# Altium project CHILD_BOARD.PrjPcb
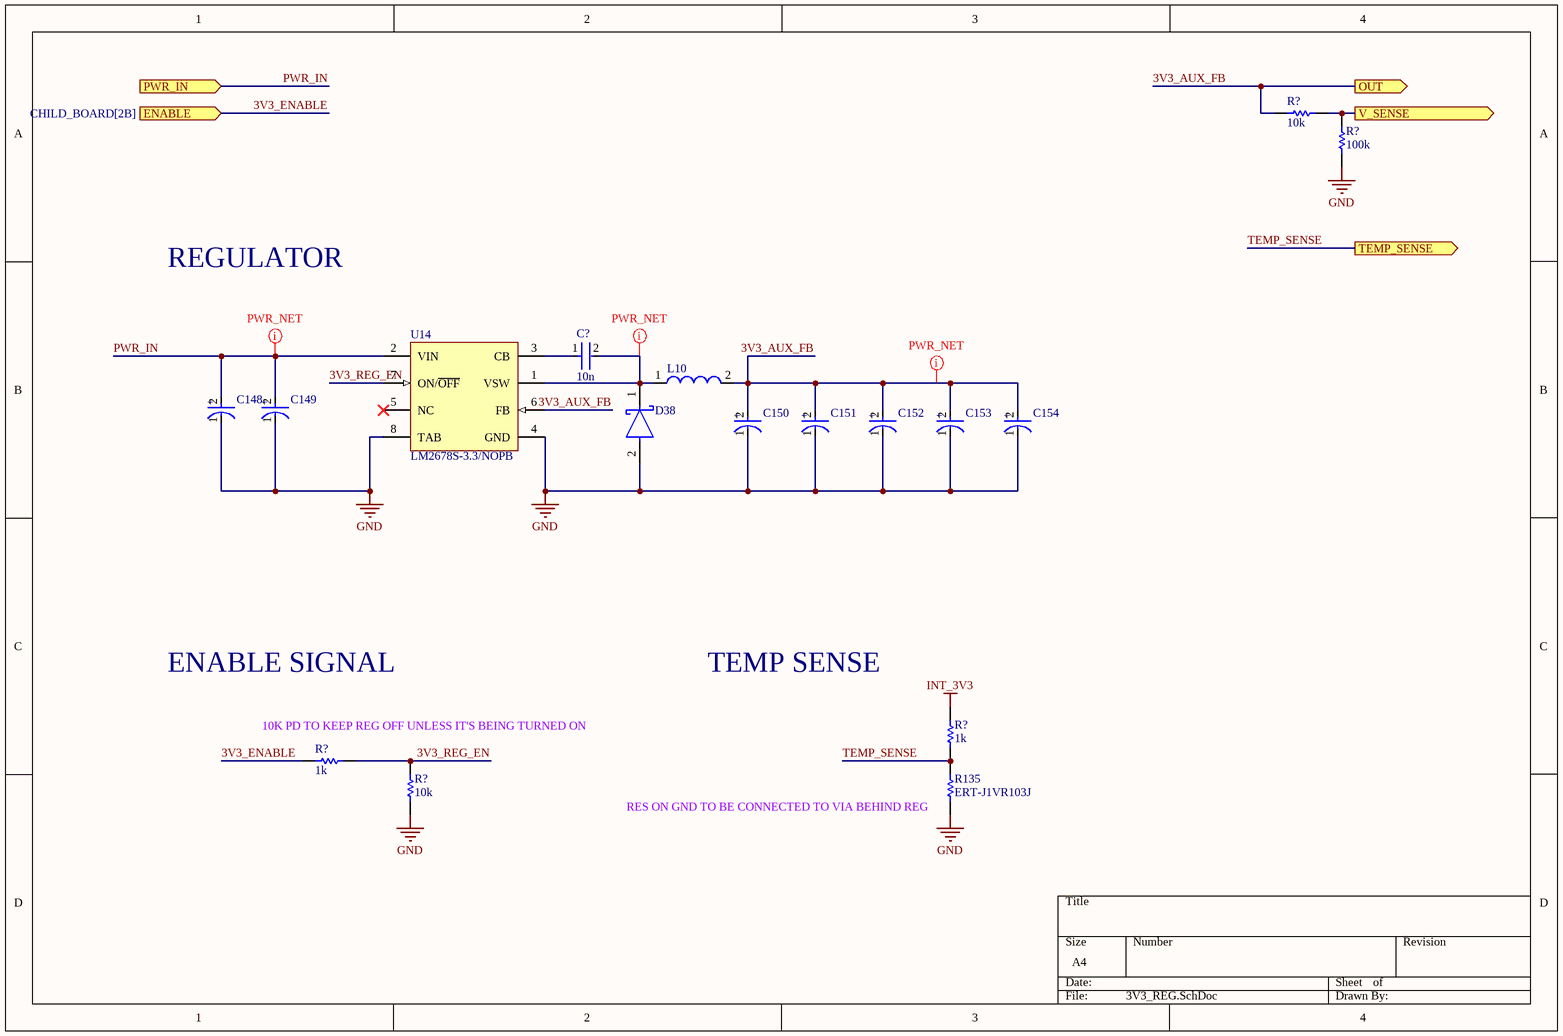
[diagram p0: 3V3_REG.SchDoc]
3 sheets, 44 parts. Net scope: flat (ports and power ports of the same name join across sheets).
Board file: CHILD_BOARD_revA.PcbDoc
Sheets:
  3V3_REG.SchDoc
  5V_REG.SchDoc
  INT_REG.SchDoc

## Sheet 3V3_REG.SchDoc
size A4; SheetNumber: 3; SheetTotal: 12

### Parts
(Parts that share a designator on the sheet are numbered #1, #2 ... from top to bottom, then left to right.)
C148  EEHZA1V680XP  [FP-EEH-D8-MFG]  (value not drawn)
C149  EEHZA1V680XP  [FP-EEH-D8-MFG]  (value not drawn)
C150  16SVPC120M  [FP-OS-CON-SMT-E7-MFG]  (value not drawn)
C151  16SVPC120M  [FP-OS-CON-SMT-E7-MFG]  (value not drawn)
C152  16SVPC120M  [FP-OS-CON-SMT-E7-MFG]  (value not drawn)
C153  16SVPC120M  [FP-OS-CON-SMT-E7-MFG]  (value not drawn)
C154  16SVPC120M  [FP-OS-CON-SMT-E7-MFG]  (value not drawn)
C?#1  10n  [FP-0402-L_1_0_0_05-W_0_5-IPC_A]
D38  B540C-13-F  [FP-SMC-MFG]  (value not drawn)
L10  74477110  [WE-PD-L]  (value not drawn)
R135  ERT-J1VR103J  [RESC1608X90X30ML15T20]
R?#1  10k  [R0603B]
R?#2  100k  [R0603B]
R?#3  1k  [R0603B]
R?#4  1k  [R0603B]
R?#5  10k  [R0603B]
U14  LM2678S-3.3/NOPB  [KTW0007B_N]

### Ports
ENABLE (in, see CHILD_BOARD[2B]), OUT (out, see CHILD_BOARD[3B]), PWR_IN (in, see CHILD_BOARD[2B]), TEMP_SENSE (out, see CHILD_BOARD[3B]), V_SENSE (out, see CHILD_BOARD[3B])

### Nets
GND: C148.1(C) C149.1(C) C150.1(C) C151.1(C) C152.1(C) C153.1(C) C154.1(C) D38.2(A) R135.1 R?#2.2 R?#5.2 U14.4(GND) U14.8(TAB)
INT_3V3: R?#3.1
3V3_AUX_FB: C150.2(A) C151.2(A) C152.2(A) C153.2(A) C154.2(A) L10.2 R?#1.1 U14.6(FB) ; port OUT
3V3_ENABLE: R?#4.2 ; port ENABLE
3V3_REG_EN: R?#4.1 R?#5.1 U14.7(ON/~{OFF})
PWR_IN: C148.2(A) C149.2(A) U14.2(VIN) ; port PWR_IN
TEMP_SENSE: R135.2 R?#3.2 ; port TEMP_SENSE
NetC?#1_1: C?#1.1 U14.3(CB)
NetC?#1_2: C?#1.2 D38.1(C) L10.1 U14.1(VSW)
NetR?#1_2: R?#1.2 R?#2.1 ; port V_SENSE

Not connected (* = marked no-connect by the designer): U14 5(NC)*

### Layout directives
net class PWR: 3V3_AUX_FB, NetC?#1_2, PWR_IN

### Notes on the sheet
- REGULATOR
- ENABLE SIGNAL
- TEMP SENSE
- (near R?#4) 10K PD TO KEEP REG OFF UNLESS IT'S BEING TURNED ON
- RES ON GND TO BE CONNECTED TO VIA BEHIND REG
- (in symbol CMP-05428-000021-2) +
- (in symbol CMP-05428-001211-1) +

### Library data of the parts
C148 C149 = CMP-05428-001211-1: Conductive Polymer Hybrid Aluminum Electrolytic Capacitors 68uF ±20% 35V RADIAL SMT 6.3x7.7mm; Leakage Current: 23.8uA; Ripple Current (AC): 2A; Polarity: Polar; Life (Hours): 5000Hour; ESR (Equivalent Series Resistance): 35mR; Lead Diameter: 0.65mm; Termination: SMD/SMT; Case/Package: Radial; Package Quantity: 900; Radiation Hardening: No; Max Operating Temperature: 105°C; Capacitance: 68uF; Voltage Rating: 35V; Number of Pins: 8; Mount: Surface Mount; Technology: HYBRID; Diameter: 6.3mm; Min Operating Temperature: -55°C; Length: 7.7mm; Ratings: AEC-Q200; Height - Seated (Max): 0.315inch; Ripple Current: 2A; Lead Free: Lead Free; Voltage: 35V; Lead Pitch: 1.8mm; Voltage Rating (DC): 35V; REACH SVHC: No SVHC; Material: Polymer; Height: 7.7mm; Tolerance: 20%; Construction: Cylindrical; Packaging: Tape and Reel; Series: ZA
C150-C154 = CMP-05428-000021-2: Conductive Polymer Aluminum Solid Capacitors (OS-CON) 120uF ±20% 16V RADIAL SMT 8x6.9mm; Leakage Current: 500uA; Ripple Current: 2.9A; ESR (Equivalent Series Resistance): 27mR; Polarity: Polar; Dissipation Factor: 12%; Life (Hours): 2000Hour; Lead Free: Lead Free; Voltage Rating (DC): 16V; Min Operating Temperature: -55°C; Height - Seated (Max): 0.276inch; Case/Package: Radial; REACH SVHC: No SVHC; Diameter: 8mm; Mount: Surface Mount; Package Quantity: 1000; Construction: Cylindrical; Max Operating Temperature: 105°C; Capacitance: 120uF; Voltage: 16V; Length: 6.9mm; Tolerance: 20%; RoHS Compliant: Yes; Series: OS-CON, SVPC; Packaging: Tape and Reel; Voltage Rating: 16V; Termination: SMD/SMT; Number of Pins: 7; Ripple Current (AC): 2.9A; Height: 6.9mm
C?#1 = CMP-001-00058-1: LARGE PADS, 0402 CAP, CHANGE COMMENT TO MATCH REAL P/N; Capacitor Type: Ceramic; Min Operating Temperature: -55°C; Mounting Technology: Surface Mount; Pins: 2; Case/Package: 0402; RoHS Compliant: Yes; Max Operating Temperature: 85°C
D38 = CMP-2000-05097-3: DIODE SCHOTTKY 40V 5A SMC; Manufacturer: Diodes Inc.; Automotive Grade: NA; Peak Reverse Current: 0.5mA; Value: 300pF; Max Junction Temp: +150°C; Max Surge Forward Current: 100A; Standoff Height: 0.1mm; Digikey Description: DIODE SCHOTTKY 40V 5A SMC; Temperature Range Low: -55°C; Manufacturer Part Number: B540C-13-F; Octopart: https://octopart.com/b540c-13-f-diodes+inc.-325873; Lead Free: Yes; Reverse Voltage: 40V; RoHS: TRUE; Category: Diode; Mouser Description: Diode: Schottky rectifying; SMD; 40V; 5A; SMC; Package: reel, tape; ComponentLink2Description: Datasheet; Temperature Range High: +150°C; Automotive: No; Footprint Url: https://www.diodes.com/assets/Package-Files/SMC.pdf; Device Class L3: Schottky Diodes; Height: 2.5mm; Forward Current: 5A; Temperature: -55°C to +150°C; Package: SMC; ComponentLink2URL: https://www.diodes.com/assets/Datasheets/ds13012.pdf; Device Class L2: Diodes; Max Repetitive Reverse Voltage: 40V; Device Class L1: Discrete Semiconductors; Capacitance: 300pF
L10 = CMP-0227-00708-1: SMD-Shielded Power Inductor WE-PD, L = 10.0 µH; Inductance: 10.0 ÂµH; ComponentLink2Description: Datasheet; DatasheetVersion: ver 7, Sep-2006; PackageVersion: 2006; ComponentLink1URL: http://www.we-online.com; ComponentLink1Description: Manufacturer Link; ComponentLink2URL: http://www.we-online.de/katalog/media/pdf/74477110.pdf; PackageDescription: SMD Inductor, 2-Leads, Body 12.0 x 12.0 mm; PackageReference: WE-PD-L
R135 = CMP-2000-00869-1: Manufacturer: Panasonic; Part Number: ERT-J1VR103J
R?#1-R?#5 = CMP-009-00002-14: Resistor
  R?#1 R?#5: Value: 10k
  R?#2: Value: 100k
  R?#3 R?#4: Value: 1k
U14 = CMP-0069-00195-3: SIMPLE SWITCHER® High Efficiency 5A Step-Down Voltage Regulator, 7-pin TO-263, Pb-Free; Manufacturer: Texas Instruments; PackageTopMarking: NSUZXYTTE#*LM2678*S-3.3; PowerWise: N; PackageReference: KTW0007B; Code_JEDEC: MO-169-AC; CompType: Switcher; RoHS: Y; PackageDescription: TO-263, Molded, .400 x .390 x .180in Body, 7 Lead, .050in Pitch, Surface Mount; ComponentLink1Description: Datasheet URL; PinCount: 7; ComponentLink1URL: http://www.ti.com/general/docs/lit/getliterature.tsp?genericPartNumber=LM2678&fileType=pdf

## Sheet 5V_REG.SchDoc
size A4; SheetNumber: 4; SheetTotal: 12
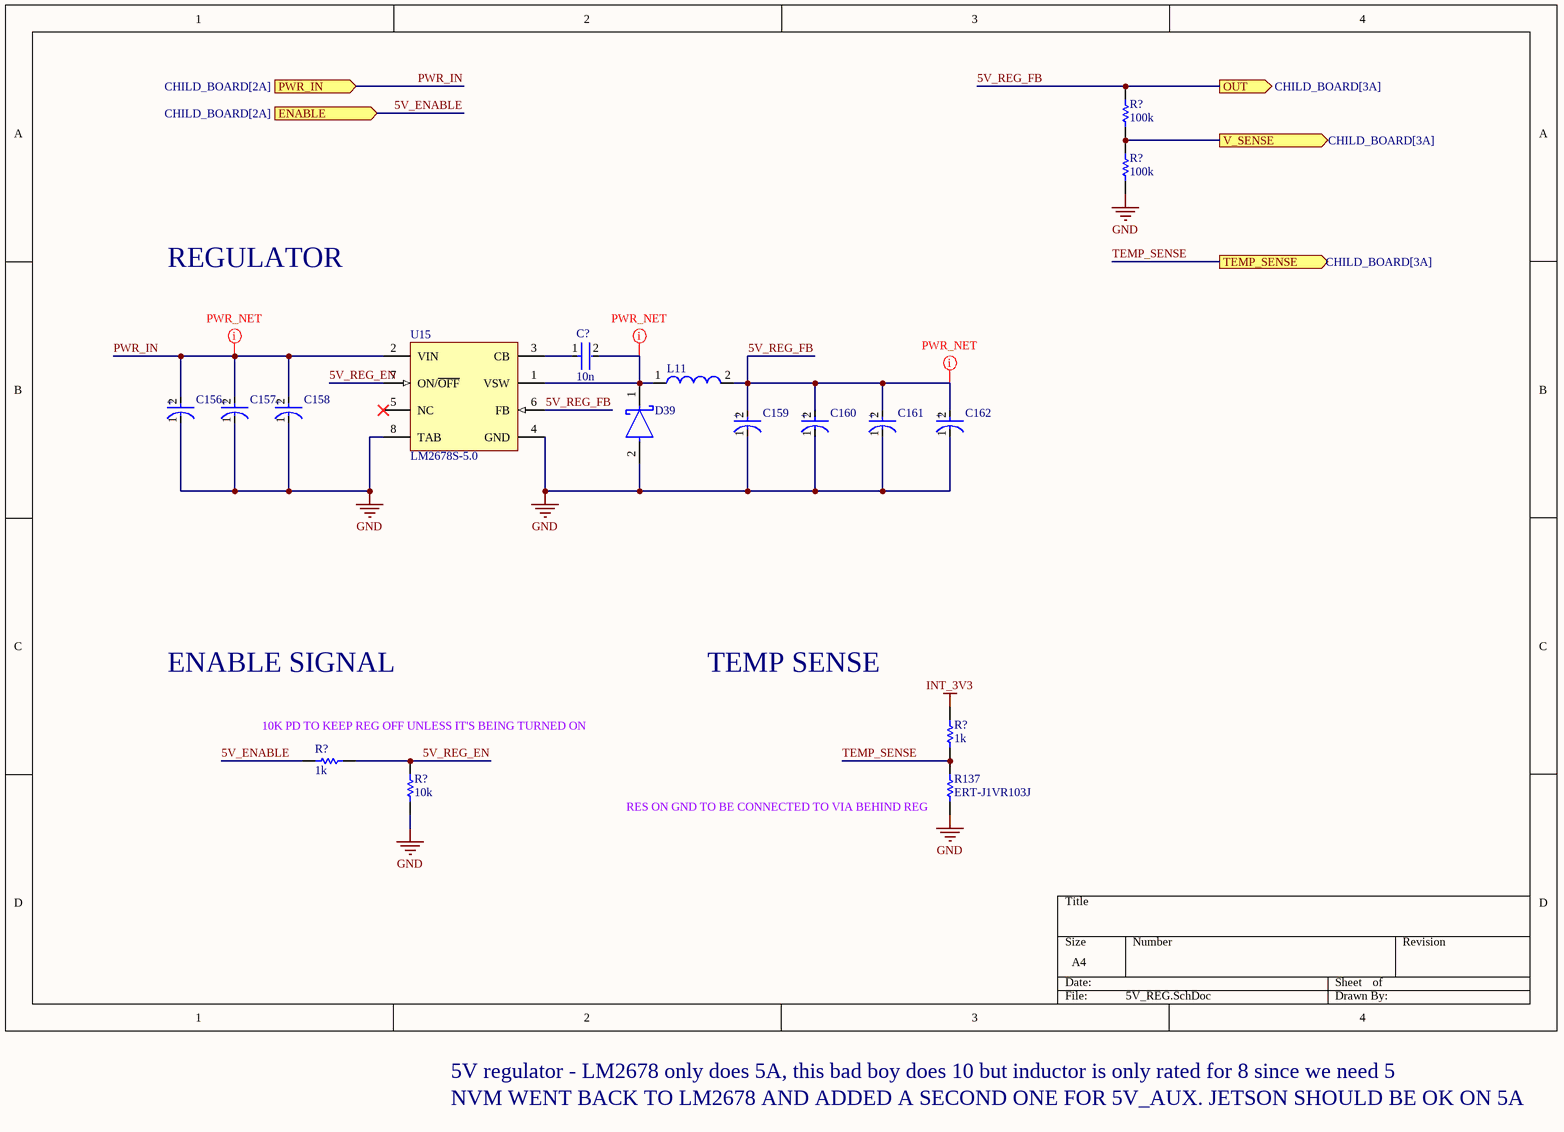
[diagram p1: 5V_REG.SchDoc]

### Parts
(Parts that share a designator on the sheet are numbered #1, #2 ... from top to bottom, then left to right.)
C156  20SVP33M  [FP-OS-CON-SMT-E7-MFG]  (value not drawn)
C157  20SVP33M  [FP-OS-CON-SMT-E7-MFG]  (value not drawn)
C158  20SVP33M  [FP-OS-CON-SMT-E7-MFG]  (value not drawn)
C159  EEE-1AA101WR  [FP-SC-MFG]  (value not drawn)
C160  EEE-1AA101WR  [FP-SC-MFG]  (value not drawn)
C161  EEE-1AA101WR  [FP-SC-MFG]  (value not drawn)
C162  EEE-1AA101WR  [FP-SC-MFG]  (value not drawn)
C?_REG_1  10n  [FP-0402-L_1_0_0_05-W_0_5-IPC_A]
D39  B540C-13-F  [FP-SMC-MFG]  (value not drawn)
L11  74477110  [WE-PD-L]  (value not drawn)
R137  ERT-J1VR103J  [RESC1608X90X30ML15T20]
R?_REG_1#1  100k  [R0603B]
R?_REG_1#2  100k  [R0603B]
R?_REG_1#3  1k  [R0603B]
R?_REG_1#4  1k  [R0603B]
R?_REG_1#5  10k  [R0603B]
U15  LM2678S-5.0  [KTW0007B_N]

### Ports
ENABLE (in, see CHILD_BOARD[2A]), OUT (out, see CHILD_BOARD[3A]), PWR_IN (in, see CHILD_BOARD[2A]), TEMP_SENSE (out, see CHILD_BOARD[3A]), V_SENSE (out, see CHILD_BOARD[3A])

### Nets
GND: C156.1(C) C157.1(C) C158.1(C) C159.1(C) C160.1(C) C161.1(C) C162.1(C) D39.2(A) R137.1 R?_REG_1#2.2 R?_REG_1#5.2 U15.4(GND) U15.8(TAB)
INT_3V3: R?_REG_1#3.1
5V_ENABLE: R?_REG_1#4.2 ; port ENABLE  [project net 3V3_ENABLE]
5V_REG_EN: R?_REG_1#4.1 R?_REG_1#5.1 U15.7(ON/~{OFF})
5V_REG_FB: C159.2(A) C160.2(A) C161.2(A) C162.2(A) L11.2 R?_REG_1#1.1 U15.6(FB) ; port OUT  [project net 3V3_AUX_FB]
PWR_IN: C156.2(A) C157.2(A) C158.2(A) U15.2(VIN) ; port PWR_IN
TEMP_SENSE: R137.2 R?_REG_1#3.2 ; port TEMP_SENSE
NetC?_REG_1_1: C?_REG_1.1 U15.3(CB)
NetC?_REG_1_2: C?_REG_1.2 D39.1(C) L11.1 U15.1(VSW)
NetR?#1_2: R?_REG_1#1.2 R?_REG_1#2.1 ; port V_SENSE

Not connected (* = marked no-connect by the designer): U15 5(NC)*

### Layout directives
net class PWR: 3V3_AUX_FB, NetC?_REG_1_2, PWR_IN

### Notes on the sheet
- REGULATOR
- ENABLE SIGNAL
- TEMP SENSE
- (near R?_REG_1#4) 10K PD TO KEEP REG OFF UNLESS IT'S BEING TURNED ON
- RES ON GND TO BE CONNECTED TO VIA BEHIND REG
- 5V regulator - LM2678 only does 5A, this bad boy does 10 but inductor is only rated for 8 since we need 5
- NVM WENT BACK TO LM2678 AND ADDED A SECOND ONE FOR 5V_AUX. JETSON SHOULD BE OK ON 5A
- (in symbol CMP-05427-000047-1) +
- (in symbol CMP-05428-001387-1) +

### Library data of the parts
C156-C158 = CMP-05428-001387-1: Conductive Polymer Aluminum Solid Capacitors (OS-CON) 33uF ±20% 20V RADIAL SMT 8x6.9mm; Polarity: Polar; Life (Hours): 2000Hour; Leakage Current: 132uA; ESR (Equivalent Series Resistance): 45mR; Ripple Current (AC): 1.89A; Dissipation Factor: 12%; Construction: Cylindrical; Capacitance: 33uF; Max Operating Temperature: 105°C; Min Operating Temperature: -55°C; Voltage: 20V; Number of Pins: 7; Termination: SMD/SMT; Package Quantity: 1000; Packaging: Tape and Reel; REACH SVHC: No SVHC; Mount: Surface Mount; Tolerance: 20%; Voltage Rating (DC): 20V; Height: 6.9mm; Series: OS-CON™, SVP; Diameter: 8mm; Length: 6.9mm; Ripple Current: 1.89A; RoHS Compliant: Yes; Height - Seated (Max): 0.276inch; Case/Package: Radial; Voltage Rating: 20V
C159-C162 = CMP-05427-000047-1: CAP ALUM 100UF 20% 10V SMD; Life (Hours): 1000Hour; Ripple Current: 50mA; Packaging: Tape and Reel; Diameter: 5mm; Voltage Rating (DC): 10V; Mount: Surface Mount; Max Operating Temperature: 85°C; Length: 5.5mm; Case/Package: Radial; Height: 5.4mm; Construction: Cylindrical; Termination: SMD/SMT; Height - Seated (Max): 0.213inch; Series: S; Min Operating Temperature: -40°C; Capacitance: 100uF; Tolerance: 20%; Voltage Rating: 10V; Package Quantity: 1; Radiation Hardening: No; Ripple Current (AC): 50mA; Lead Free: Lead Free; RoHS Compliant: Yes; Contact Plating: Tin
C?_REG_1 = CMP-001-00058-1: as C?#1 on sheet 3V3_REG; Min Operating Temperature: -55°C; Mounting Technology: Surface Mount; Pins: 2; Case/Package: 0402; RoHS Compliant: Yes; Max Operating Temperature: 85°C
D39 = CMP-2000-05097-3: as D38 on sheet 3V3_REG; Digikey Description: DIODE SCHOTTKY 40V 5A SMC; Temperature Range Low: -55°C; Manufacturer Part Number: B540C-13-F; Octopart: https://octopart.com/b540c-13-f-diodes+inc.-325873; Lead Free: Yes; Reverse Voltage: 40V; RoHS: TRUE; Category: Diode; Mouser Description: Diode: Schottky rectifying; SMD; 40V; 5A; SMC; Package: reel, tape; ComponentLink2Description: Datasheet; Temperature Range High: +150°C; Automotive: No; Footprint Url: https://www.diodes.com/assets/Package-Files/SMC.pdf; Device Class L3: Schottky Diodes; Height: 2.5mm; Forward Current: 5A; Temperature: -55°C to +150°C; Package: SMC; ComponentLink2URL: https://www.diodes.com/assets/Datasheets/ds13012.pdf; Device Class L2: Diodes; Max Repetitive Reverse Voltage: 40V; Device Class L1: Discrete Semiconductors; Capacitance: 300pF
L11 = CMP-0227-00708-1: as L10 on sheet 3V3_REG; ComponentLink2Description: Datasheet; DatasheetVersion: ver 7, Sep-2006; PackageVersion: 2006; ComponentLink1URL: http://www.we-online.com; ComponentLink1Description: Manufacturer Link; ComponentLink2URL: http://www.we-online.de/katalog/media/pdf/74477110.pdf; PackageDescription: SMD Inductor, 2-Leads, Body 12.0 x 12.0 mm; PackageReference: WE-PD-L
R137 = CMP-2000-00869-1: Manufacturer: Panasonic; Part Number: ERT-J1VR103J
R?_REG_1#1-R?_REG_1#5 = CMP-009-00002-14: Resistor
  R?#6 R?#7: Value: 100k
  R?#8 R?#9: Value: 1k
  R?#10: Value: 10k
U15 = CMP-0069-00190-3: SIMPLE SWITCHER® High Efficiency 5A Step-Down Voltage Regulator, 7-pin TO-263; Manufacturer: Texas Instruments; PowerWise: N; PackageTopMarking: NSUZXYTTE#*LM2678*S-5.0; RoHS: N; PinCount: 7; Code_JEDEC: MO-169-AC; ComponentLink1URL: http://www.ti.com/general/docs/lit/getliterature.tsp?genericPartNumber=LM2678&fileType=pdf; ComponentLink1Description: Datasheet URL; PackageReference: KTW0007B; PackageDescription: TO-263, Molded, .400 x .390 x .180in Body, 7 Lead, .050in Pitch, Surface Mount; CompType: Switcher

## Sheet INT_REG.SchDoc
size A4; SheetNumber: 11; SheetTotal: 12
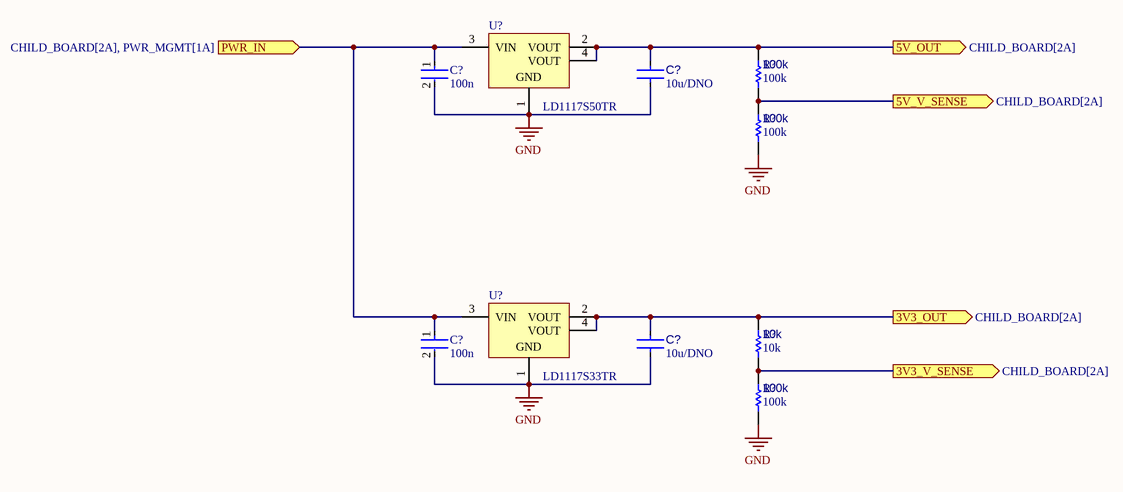
[diagram p2: INT_REG.SchDoc]

### Parts
(Parts that share a designator on the sheet are numbered #1, #2 ... from top to bottom, then left to right.)
C?#2  100n  [FP-0402-L_1_0_0_05-W_0_5-IPC_A]
C?#3  10u/DNO  [C0805A]
C?#4  100n  [FP-0402-L_1_0_0_05-W_0_5-IPC_A]
C?#5  10u/DNO  [C0805A]
R?#6  100k  [R0603B]
R?#7  100k  [R0603B]
R?#8  10k  [R0603B]
R?#9  100k  [R0603B]
U?#1  LD1117S50TR  [SOT-223_L]
U?#2  LD1117S33TR  [SOT-223_L]

### Ports
3V3_OUT (out, see CHILD_BOARD[2A]), 3V3_V_SENSE (out, see CHILD_BOARD[2A]), 5V_OUT (out, see CHILD_BOARD[2A]), 5V_V_SENSE (out, see CHILD_BOARD[2A]), PWR_IN (in, see CHILD_BOARD[2A], PWR_MGMT[1A])

### Nets
GND: C?#2.2 C?#3.2 C?#4.2 C?#5.2 R?#7.2 R?#9.2 U?#1.1(GND) U?#2.1(GND)
PWR_IN: C?#2.1 C?#4.1 U?#1.3(VIN) U?#2.3(VIN) ; port PWR_IN
NetC?#3_1: C?#3.1 R?#6.1 U?#1.2(VOUT) U?#1.4(VOUT) ; port 5V_OUT
NetC?#5_1: C?#5.1 R?#8.1 U?#2.2(VOUT) U?#2.4(VOUT) ; port 3V3_OUT
NetR?#6_2: R?#6.2 R?#7.1 ; port 5V_V_SENSE
NetR?#8_2: R?#8.2 R?#9.1 ; port 3V3_V_SENSE

### Library data of the parts
C?#2 C?#4 = CMP-001-00058-1: as C?#1 on sheet 3V3_REG; Min Operating Temperature: -55°C; Mounting Technology: Surface Mount; Pins: 2; Case/Package: 0402; RoHS Compliant: Yes; Max Operating Temperature: 85°C
C?#3 C?#5 = CMP-001-00000-11: Non-polarized capacitor
R?#6-R?#9 = CMP-009-00002-14: Resistor
  R?#11 R?#12 R?#14: Value: 100k
  R?#13: Value: 10k
U?#1 = CMP-0244-00312-1: Fixed Low Drop Positive Voltage Regulator, 5V, 4-Pin SOT-223, Tape and Reel; ComponentLink1URL: http://www.st.com; DatasheetVersion: 1/11/2011; PackageDescription: 4-Pin SOT-223 Package, 6.5 x 3.5 mm Body, 2.3 mm Pitch, 7 mm Lead Span; ComponentLink2URL: http://www.st.com/internet/com/TECHNICAL_RESOURCES/TECHNICAL_LITERATURE/DATASHEET/CD00000544.pdf; ComponentLink1Description: Manufacturer URL; PackageReference: SOT-223; PackageVersion: 2010; ComponentLink2Description: Datasheet
U?#2 = CMP-0244-00310-1: Fixed Low Drop Positive Voltage Regulator, 3.3V, 4-Pin SOT-223, Tape and Reel; ComponentLink2Description: Datasheet; PackageDescription: 4-Pin SOT-223 Package, 6.5 x 3.5 mm Body, 2.3 mm Pitch, 7 mm Lead Span; PackageVersion: 2010; ComponentLink2URL: http://www.st.com/internet/com/TECHNICAL_RESOURCES/TECHNICAL_LITERATURE/DATASHEET/CD00000544.pdf; PackageReference: SOT-223; DatasheetVersion: 1/11/2011; ComponentLink1Description: Manufacturer URL; ComponentLink1URL: http://www.st.com

## Nets that join several sheets
GND: 3V3_REG (13 pins), 5V_REG (13 pins), INT_REG (8 pins)
INT_3V3: 3V3_REG (R?#3.1), 5V_REG (R?_REG_1#3.1)
3V3_AUX_FB: 3V3_REG (8 pins), 5V_REG (7 pins)
3V3_ENABLE: 3V3_REG (R?#4.2), 5V_REG (R?_REG_1#4.2)
NetR?#1_2: 3V3_REG (R?#1.2 R?#2.1), 5V_REG (R?_REG_1#1.2 R?_REG_1#2.1)
PWR_IN: 3V3_REG (C148.2 C149.2 U14.2), 5V_REG (C156.2 C157.2 C158.2 U15.2), INT_REG (C?#2.1 C?#4.1 U?#1.3 U?#2.3)
TEMP_SENSE: 3V3_REG (R135.2 R?#3.2), 5V_REG (R137.2 R?_REG_1#3.2)